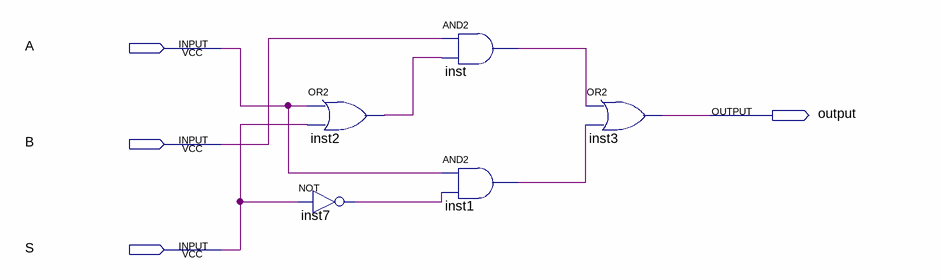
[diagram p0: schematic sheet]
// Quartus schematic mux21.bdf as structural Verilog: 5 symbols, 4 pins
module mux21 (
  input  A,
  input  B,
  input  S,
  output \output 
);

  wire inst1_out, inst2_out, inst7_out, inst_out;

  or inst2 (inst2_out, A, S);
  not inst7 (inst7_out, S);
  and inst (inst_out, B, inst2_out);
  and inst1 (inst1_out, A, inst7_out);
  or inst3 (\output , inst_out, inst1_out);
endmodule
